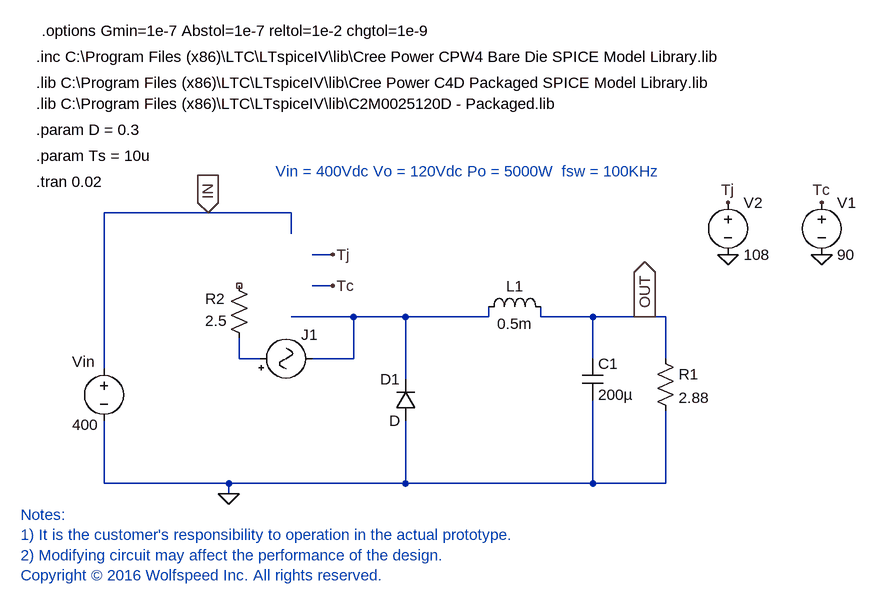
[diagram p0: schematic 5KW Buck converter.asc]
5KW Buck converter.asc, the LTspice schematic file:
Version 4
SHEET 1 1300 680
WIRE -688 -112 -848 -112
WIRE -560 -112 -688 -112
WIRE -560 -80 -560 -112
WIRE -496 -48 -528 -48
WIRE -496 0 -528 0
WIRE -464 48 -560 48
WIRE -384 48 -464 48
WIRE -256 48 -256 32
WIRE -256 48 -384 48
WIRE -176 48 -176 32
WIRE -96 48 -176 48
WIRE -16 48 -96 48
WIRE 16 48 -16 48
WIRE -640 112 -640 80
WIRE -608 112 -640 112
WIRE -464 112 -464 48
WIRE -464 112 -528 112
WIRE -96 112 -96 48
WIRE 16 112 16 48
WIRE -848 128 -848 -112
WIRE -384 144 -384 48
WIRE -848 304 -848 208
WIRE -656 304 -848 304
WIRE -384 304 -384 208
WIRE -384 304 -656 304
WIRE -96 304 -96 176
WIRE -96 304 -384 304
WIRE 16 304 16 192
WIRE 16 304 -96 304
WIRE -656 320 -656 304
WIRE 0 0 0 0
FLAG -656 320 0
FLAG -16 48 OUT
IOPIN -16 48 Out
FLAG -688 -112 IN
IOPIN -688 -112 In
FLAG 256 -48 0
FLAG 112 -48 0
FLAG -496 -48 Tj
FLAG 112 -128 Tj
FLAG -496 0 Tc
FLAG 256 -128 Tc
SYMBOL voltage -848 112 R0
WINDOW 123 0 0 Left 2
WINDOW 39 0 0 Left 2
WINDOW 0 -49 5 Left 2
WINDOW 3 -49 102 Left 2
SYMATTR InstName Vin
SYMATTR Value 400
SYMBOL ind -272 48 R270
WINDOW 0 32 56 VTop 2
WINDOW 3 5 56 VBottom 2
SYMATTR InstName L1
SYMATTR Value 0.5m
SYMATTR SpiceLine Rser=0 Rpar=0
SYMBOL cap -112 112 R0
SYMATTR InstName C1
SYMATTR Value 200µ
SYMBOL Misc\\signal -624 112 R270
WINDOW 0 21 92 VTop 2
WINDOW 3 -34 35 Invisible 2
WINDOW 123 0 0 Left 2
WINDOW 39 -60 56 VBottom 2
SYMATTR InstName J1
SYMATTR Value PULSE(-5 20 0 1n 1n {D*Ts} {Ts})
SYMBOL res 0 96 R0
SYMATTR InstName R1
SYMATTR Value 2.88
SYMBOL voltage 256 -144 R0
SYMATTR InstName V1
SYMATTR Value 90
SYMBOL voltage 112 -144 R0
SYMATTR InstName V2
SYMATTR Value 108
SYMBOL res -656 -16 R0
WINDOW 0 -36 36 Left 2
WINDOW 3 -36 70 Left 2
SYMATTR InstName R2
SYMATTR Value 2.5
SYMBOL diode -368 208 R180
WINDOW 0 24 64 Left 2
WINDOW 3 24 0 Left 2
SYMATTR InstName D1
TEXT -952 -240 Left 2 !.param D = 0.3
TEXT -952 -200 Left 2 !.param Ts = 10u
TEXT -952 -312 Left 2 !.lib C:\\Program Files (x86)\\LTC\\LTspiceIV\\lib\\Cree Power C4D Packaged SPICE Model Library.lib
TEXT -952 -280 Left 2 !.lib C:\\Program Files (x86)\\LTC\\LTspiceIV\\lib\\C2M0025120D - Packaged.lib
TEXT -952 -160 Left 2 !.tran 0.02
TEXT -584 -176 Left 2 ;Vin = 400Vdc Vo = 120Vdc Po = 5000W  fsw = 100KHz
TEXT -952 -352 Left 2 !.inc C:\\Program Files (x86)\\LTC\\LTspiceIV\\lib\\Cree Power CPW4 Bare Die SPICE Model Library.lib
TEXT -976 352 Left 2 ;Notes:\n1) It is the customer's responsibility to operation in the actual prototype.\n2) Modifying circuit may affect the performance of the design.\nCopyright © 2016 Wolfspeed Inc. All rights reserved.
TEXT -944 -392 Left 2 !.options Gmin=1e-7 Abstol=1e-7 reltol=1e-2 chgtol=1e-9

The netlist it stands for:
* 5KW Buck converter.asc
Vin IN 0 400
L1 N001 OUT 0.5m Rser=0 Rpar=0
C1 OUT 0 200µ
V§J1 N002 N001 PULSE(-5 20 0 1n 1n {D*Ts} {Ts})
R1 OUT 0 2.88
V1 Tc 0 90
V2 Tj 0 108
R2 NC_01 N002 2.5
D1 0 N001 D
.model D D
.lib standard.dio
.param D = 0.3
.param Ts = 10u
.lib C:\Program Files (x86)\LTC\LTspiceIV\lib\Cree Power C4D Packaged SPICE Model Library.lib
.lib C:\Program Files (x86)\LTC\LTspiceIV\lib\C2M0025120D - Packaged.lib
.tran 0.02
* Vin = 400Vdc Vo = 120Vdc Po = 5000W  fsw = 100KHz
.inc C:\Program Files (x86)\LTC\LTspiceIV\lib\Cree Power CPW4 Bare Die SPICE Model Library.lib
* Notes:
* 1) It is the customer's responsibility to operation in the actual prototype.
* 2) Modifying circuit may affect the performance of the design.
* Copyright © 2016 Wolfspeed Inc. All rights reserved.
.options Gmin=1e-7 Abstol=1e-7 reltol=1e-2 chgtol=1e-9
.backanno
.end